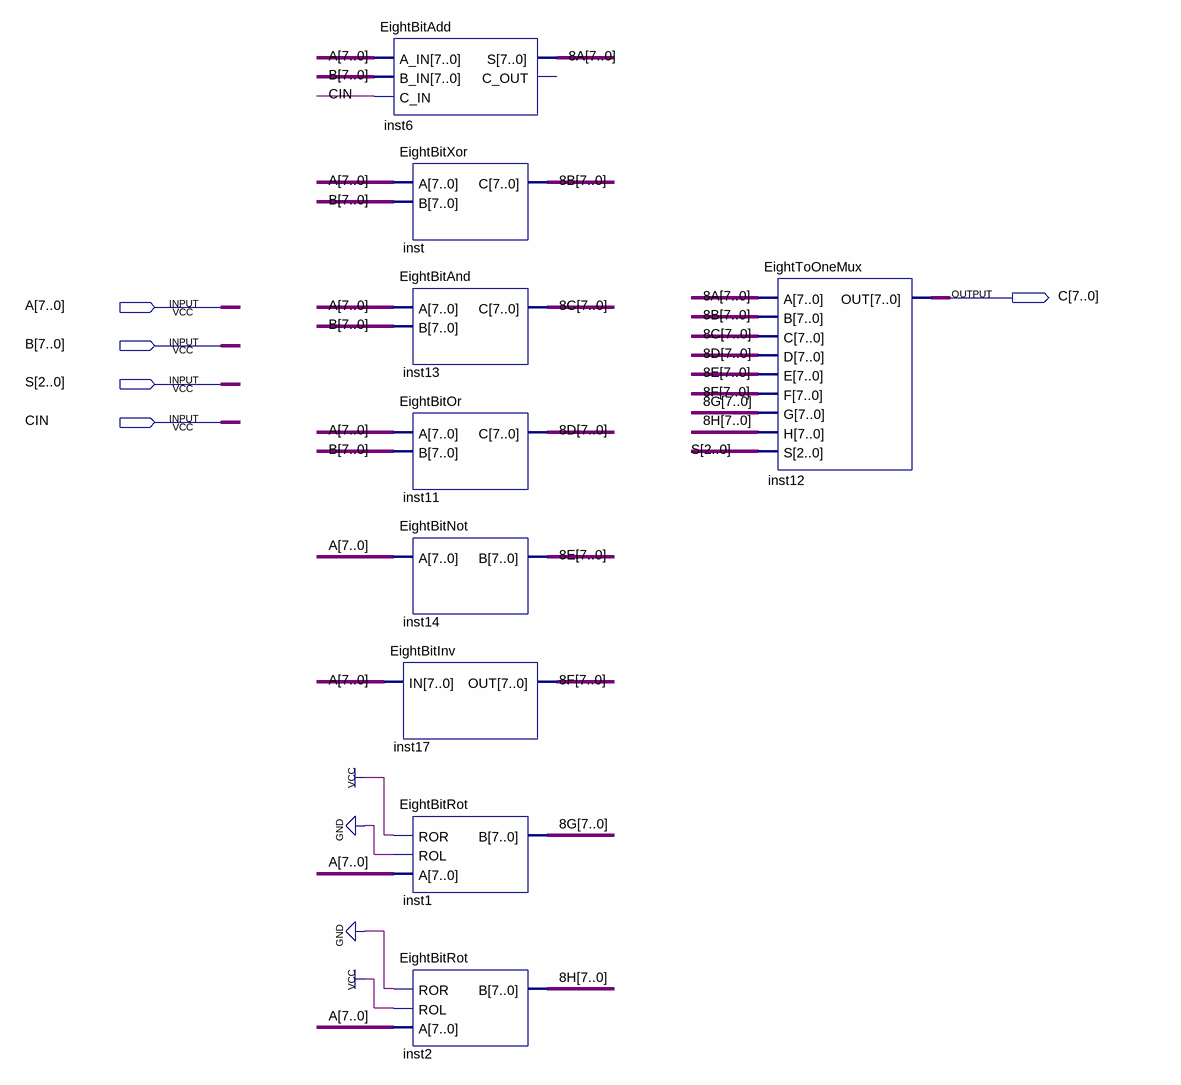
[diagram p0: schematic sheet]
// Quartus schematic alu.bdf as structural Verilog: 9 symbols, 5 pins
module alu (
  input  [7:0] A,
  input  [7:0] B,
  input  [2:0] S,
  input  CIN,
  output [7:0] C
);

  wire [7:0] \8A , \8B , \8C , \8D , \8E , \8F , \8G , \8H ;

  EightBitAdd inst6 (.A_IN(A), .B_IN(B), .C_IN(CIN), .S(\8A ));  // open: C_OUT
  EightBitXor inst (.A(A), .B(B), .C(\8B ));
  EightBitAnd inst13 (.A(A), .B(B), .C(\8C ));
  EightBitOr inst11 (.A(A), .B(B), .C(\8D ));
  EightBitNot inst14 (.A(A), .B(\8E ));
  EightBitInv inst17 (.IN(A), .OUT(\8F ));
  EightBitRot inst1 (.ROR(1'b1), .ROL(1'b0), .A(A), .B(\8G ));
  EightBitRot inst2 (.ROR(1'b0), .ROL(1'b1), .A(A), .B(\8H ));
  EightToOneMux inst12 (.A(\8A ), .B(\8B ), .C(\8C ), .D(\8D ), .E(\8E ), .F(\8F ), .G(\8G ), .H(\8H ), .S(S), .OUT(C));
endmodule
